# EAGLE schematic uUSB breakout v1 (EAGLE 7.3.0)
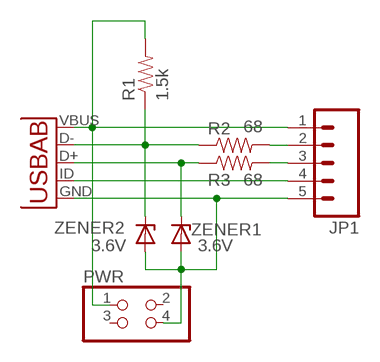
[diagram p0: schematic, sheet 1]

## Parts
JP1  M05PTH  [1X05]
PWR  PINHD-2X2  [2X02]
R1  1.5k  RESISTOR0805-RES  [0805]
R2  68  RESISTOR0805-RES  [0805]
R3  68  RESISTOR0805-RES  [0805]
UUSB  USB-AB  [USB-AB-MICRO-SMD]
ZENER1  3.6V  ZENER-DIODESOD80C  [SOD80C]
ZENER2  3.6V  ZENER-DIODESOD80C  [SOD80C]

## Nets
D-: R1.1 R2.1 UUSB.D- ZENER2.C
GND: JP1.5 PWR.4 UUSB.GND ZENER1.A ZENER2.A
ID: JP1.4 UUSB.ID(USBID)
N$1: JP1.2 R2.2
N$2: JP1.3 R3.2
N$3: R3.1 UUSB.D+ ZENER1.C
VCC: JP1.1 PWR.1 R1.2 UUSB.VBUS
Unconnected: PWR.2 PWR.3

## Library data of the parts
JP1 = SparkFun-Connectors:M05: Header 5 Standard 5-pin 0.1" header. Use with straight break away headers (SKU : PRT-00116), right angle break away headers (PRT-00553), swiss pins (PRT-00743), machine pins (PRT-00117), and female headers (PRT-00115). Molex polarized connector foot print use with SKU : PRT-08230 with associated crimp pins and housings.
PWR = pinhead:PINHD-2X2: PIN HEADER
R1-R3 = SparkFun-Passives:RESISTOR: Resistor Basic schematic elements and footprints for 0603, 1206, and PTH resistors.
UUSB = SparkFun-Connectors:USB-AB: This is a USB AB connector that is compatible with USB OTG. i.e. this connector can serve as a host or device
ZENER1 ZENER2 = diode:ZENER-DIODE: Z-Diode